# Altium schematic sheet cube.SchDoc
size A3
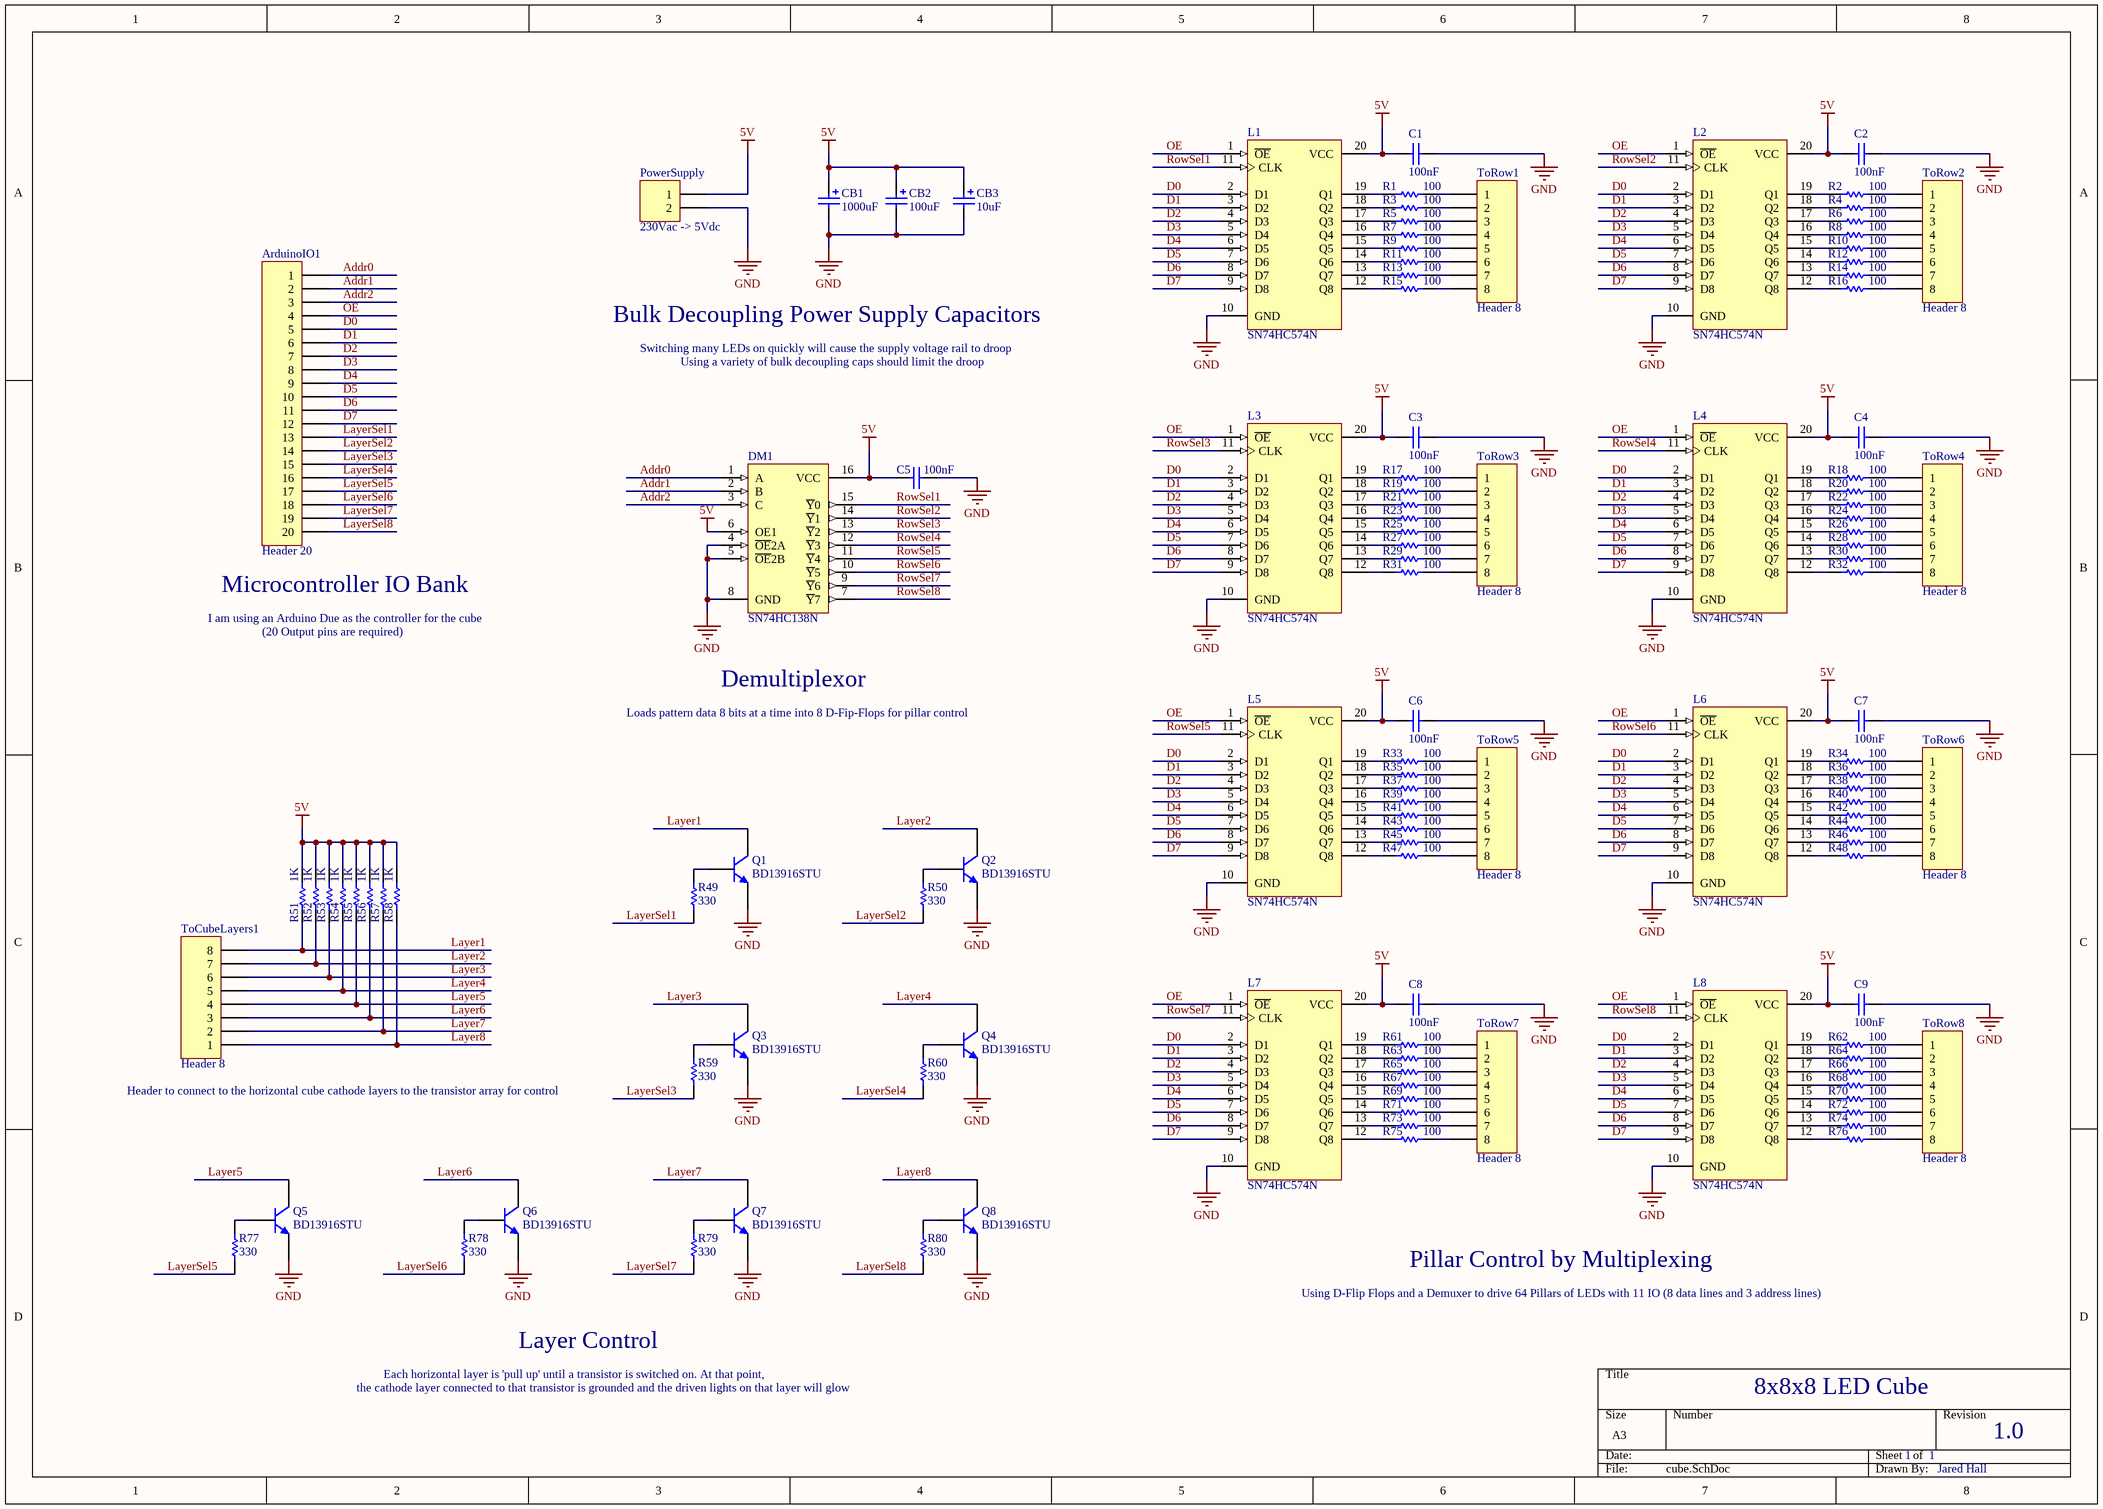
[diagram p0: cube.SchDoc]

## Parts
ArduinoIO1  Header 20  [HDR1X20]
C1  value 100nF  [RAD-0.3]  (hidden comment: Cap)
C2  value 100nF  [RAD-0.3]  (hidden comment: Cap)
C3  value 100nF  [RAD-0.3]  (hidden comment: Cap)
C4  value 100nF  [RAD-0.3]  (hidden comment: Cap)
C5  value 100nF  [RAD-0.3]  (hidden comment: Cap)
C6  value 100nF  [RAD-0.3]  (hidden comment: Cap)
C7  value 100nF  [RAD-0.3]  (hidden comment: Cap)
C8  value 100nF  [RAD-0.3]  (hidden comment: Cap)
C9  value 100nF  [RAD-0.3]  (hidden comment: Cap)
CB1  value 1000uF  [POLAR0.8]  (hidden comment: Cap Pol2)
CB2  value 100uF  [POLAR0.8]  (hidden comment: Cap Pol2)
CB3  value 10uF  [POLAR0.8]  (hidden comment: Cap Pol2)
DM1  SN74HC138N  [N016]
L1  SN74HC574N  [N020]
L2  SN74HC574N  [N020]
L3  SN74HC574N  [N020]
L4  SN74HC574N  [N020]
L5  SN74HC574N  [N020]
L6  SN74HC574N  [N020]
L7  SN74HC574N  [N020]
L8  SN74HC574N  [N020]
PowerSupply  230Vac -> 5Vdc  [HDR1X2]
Q1  BD13916STU  [TO-226-AA]
Q2  BD13916STU  [TO-226-AA]
Q3  BD13916STU  [TO-226-AA]
Q4  BD13916STU  [TO-226-AA]
Q5  BD13916STU  [TO-226-AA]
Q6  BD13916STU  [TO-226-AA]
Q7  BD13916STU  [TO-226-AA]
Q8  BD13916STU  [TO-226-AA]
R1  value 100  [AXIAL-0.3]  (hidden comment: Res1)
R2  value 100  [AXIAL-0.3]  (hidden comment: Res1)
R3  value 100  [AXIAL-0.3]  (hidden comment: Res1)
R4  value 100  [AXIAL-0.3]  (hidden comment: Res1)
R5  value 100  [AXIAL-0.3]  (hidden comment: Res1)
R6  value 100  [AXIAL-0.3]  (hidden comment: Res1)
R7  value 100  [AXIAL-0.3]  (hidden comment: Res1)
R8  value 100  [AXIAL-0.3]  (hidden comment: Res1)
R9  value 100  [AXIAL-0.3]  (hidden comment: Res1)
R10  value 100  [AXIAL-0.3]  (hidden comment: Res1)
R11  value 100  [AXIAL-0.3]  (hidden comment: Res1)
R12  value 100  [AXIAL-0.3]  (hidden comment: Res1)
R13  value 100  [AXIAL-0.3]  (hidden comment: Res1)
R14  value 100  [AXIAL-0.3]  (hidden comment: Res1)
R15  value 100  [AXIAL-0.3]  (hidden comment: Res1)
R16  value 100  [AXIAL-0.3]  (hidden comment: Res1)
R17  value 100  [AXIAL-0.3]  (hidden comment: Res1)
R18  value 100  [AXIAL-0.3]  (hidden comment: Res1)
R19  value 100  [AXIAL-0.3]  (hidden comment: Res1)
R20  value 100  [AXIAL-0.3]  (hidden comment: Res1)
R21  value 100  [AXIAL-0.3]  (hidden comment: Res1)
R22  value 100  [AXIAL-0.3]  (hidden comment: Res1)
R23  value 100  [AXIAL-0.3]  (hidden comment: Res1)
R24  value 100  [AXIAL-0.3]  (hidden comment: Res1)
R25  value 100  [AXIAL-0.3]  (hidden comment: Res1)
R26  value 100  [AXIAL-0.3]  (hidden comment: Res1)
R27  value 100  [AXIAL-0.3]  (hidden comment: Res1)
R28  value 100  [AXIAL-0.3]  (hidden comment: Res1)
R29  value 100  [AXIAL-0.3]  (hidden comment: Res1)
R30  value 100  [AXIAL-0.3]  (hidden comment: Res1)
R31  value 100  [AXIAL-0.3]  (hidden comment: Res1)
R32  value 100  [AXIAL-0.3]  (hidden comment: Res1)
R33  value 100  [AXIAL-0.3]  (hidden comment: Res1)
R34  value 100  [AXIAL-0.3]  (hidden comment: Res1)
R35  value 100  [AXIAL-0.3]  (hidden comment: Res1)
R36  value 100  [AXIAL-0.3]  (hidden comment: Res1)
R37  value 100  [AXIAL-0.3]  (hidden comment: Res1)
R38  value 100  [AXIAL-0.3]  (hidden comment: Res1)
R39  value 100  [AXIAL-0.3]  (hidden comment: Res1)
R40  value 100  [AXIAL-0.3]  (hidden comment: Res1)
R41  value 100  [AXIAL-0.3]  (hidden comment: Res1)
R42  value 100  [AXIAL-0.3]  (hidden comment: Res1)
R43  value 100  [AXIAL-0.3]  (hidden comment: Res1)
R44  value 100  [AXIAL-0.3]  (hidden comment: Res1)
R45  value 100  [AXIAL-0.3]  (hidden comment: Res1)
R46  value 100  [AXIAL-0.3]  (hidden comment: Res1)
R47  value 100  [AXIAL-0.3]  (hidden comment: Res1)
R48  value 100  [AXIAL-0.3]  (hidden comment: Res1)
R49  value 330  [AXIAL-0.3]  (hidden comment: Res1)
R50  value 330  [AXIAL-0.3]  (hidden comment: Res1)
R51  value 1K  [AXIAL-0.3]  (hidden comment: Res1)
R52  value 1K  [AXIAL-0.3]  (hidden comment: Res1)
R53  value 1K  [AXIAL-0.3]  (hidden comment: Res1)
R54  value 1K  [AXIAL-0.3]  (hidden comment: Res1)
R55  value 1K  [AXIAL-0.3]  (hidden comment: Res1)
R56  value 1K  [AXIAL-0.3]  (hidden comment: Res1)
R57  value 1K  [AXIAL-0.3]  (hidden comment: Res1)
R58  value 1K  [AXIAL-0.3]  (hidden comment: Res1)
R59  value 330  [AXIAL-0.3]  (hidden comment: Res1)
R60  value 330  [AXIAL-0.3]  (hidden comment: Res1)
R61  value 100  [AXIAL-0.3]  (hidden comment: Res1)
R62  value 100  [AXIAL-0.3]  (hidden comment: Res1)
R63  value 100  [AXIAL-0.3]  (hidden comment: Res1)
R64  value 100  [AXIAL-0.3]  (hidden comment: Res1)
R65  value 100  [AXIAL-0.3]  (hidden comment: Res1)
R66  value 100  [AXIAL-0.3]  (hidden comment: Res1)
R67  value 100  [AXIAL-0.3]  (hidden comment: Res1)
R68  value 100  [AXIAL-0.3]  (hidden comment: Res1)
R69  value 100  [AXIAL-0.3]  (hidden comment: Res1)
R70  value 100  [AXIAL-0.3]  (hidden comment: Res1)
R71  value 100  [AXIAL-0.3]  (hidden comment: Res1)
R72  value 100  [AXIAL-0.3]  (hidden comment: Res1)
R73  value 100  [AXIAL-0.3]  (hidden comment: Res1)
R74  value 100  [AXIAL-0.3]  (hidden comment: Res1)
R75  value 100  [AXIAL-0.3]  (hidden comment: Res1)
R76  value 100  [AXIAL-0.3]  (hidden comment: Res1)
R77  value 330  [AXIAL-0.3]  (hidden comment: Res1)
R78  value 330  [AXIAL-0.3]  (hidden comment: Res1)
R79  value 330  [AXIAL-0.3]  (hidden comment: Res1)
R80  value 330  [AXIAL-0.3]  (hidden comment: Res1)
ToCubeLayers1  Header 8  [HDR1X8]
ToRow1  Header 8  [HDR1X8]
ToRow2  Header 8  [HDR1X8]
ToRow3  Header 8  [HDR1X8]
ToRow4  Header 8  [HDR1X8]
ToRow5  Header 8  [HDR1X8]
ToRow6  Header 8  [HDR1X8]
ToRow7  Header 8  [HDR1X8]
ToRow8  Header 8  [HDR1X8]

## Nets
5V: C1.1 C2.1 C3.1 C4.1 C5.1 C6.1 C7.1 C8.1 C9.1 CB1.1 CB2.1 CB3.1 DM1.6(OE1) DM1.16(VCC) L1.20(VCC) L2.20(VCC) L3.20(VCC) L4.20(VCC) L5.20(VCC) L6.20(VCC) L7.20(VCC) L8.20(VCC) PowerSupply.1 R51.2 R52.2 R53.2 R54.2 R55.2 R56.2 R57.2 R58.2
GND: C1.2 C2.2 C3.2 C4.2 C5.2 C6.2 C7.2 C8.2 C9.2 CB1.2 CB2.2 CB3.2 DM1.4(~{OE}2A) DM1.5(~{OE}2B) DM1.8(GND) L1.10(GND) L2.10(GND) L3.10(GND) L4.10(GND) L5.10(GND) L6.10(GND) L7.10(GND) L8.10(GND) PowerSupply.2 Q1.3(E) Q2.3(E) Q3.3(E) Q4.3(E) Q5.3(E) Q6.3(E) Q7.3(E) Q8.3(E)
Addr0: ArduinoIO1.1 DM1.1(A)
Addr1: ArduinoIO1.2 DM1.2(B)
Addr2: ArduinoIO1.3 DM1.3(C)
D0: ArduinoIO1.5 L1.2(D1) L2.2(D1) L3.2(D1) L4.2(D1) L5.2(D1) L6.2(D1) L7.2(D1) L8.2(D1)
D1: ArduinoIO1.6 L1.3(D2) L2.3(D2) L3.3(D2) L4.3(D2) L5.3(D2) L6.3(D2) L7.3(D2) L8.3(D2)
D2: ArduinoIO1.7 L1.4(D3) L2.4(D3) L3.4(D3) L4.4(D3) L5.4(D3) L6.4(D3) L7.4(D3) L8.4(D3)
D3: ArduinoIO1.8 L1.5(D4) L2.5(D4) L3.5(D4) L4.5(D4) L5.5(D4) L6.5(D4) L7.5(D4) L8.5(D4)
D4: ArduinoIO1.9 L1.6(D5) L2.6(D5) L3.6(D5) L4.6(D5) L5.6(D5) L6.6(D5) L7.6(D5) L8.6(D5)
D5: ArduinoIO1.10 L1.7(D6) L2.7(D6) L3.7(D6) L4.7(D6) L5.7(D6) L6.7(D6) L7.7(D6) L8.7(D6)
D6: ArduinoIO1.11 L1.8(D7) L2.8(D7) L3.8(D7) L4.8(D7) L5.8(D7) L6.8(D7) L7.8(D7) L8.8(D7)
D7: ArduinoIO1.12 L1.9(D8) L2.9(D8) L3.9(D8) L4.9(D8) L5.9(D8) L6.9(D8) L7.9(D8) L8.9(D8)
Layer1: Q1.1(C) R51.1 ToCubeLayers1.8
Layer2: Q2.1(C) R52.1 ToCubeLayers1.7
Layer3: Q3.1(C) R53.1 ToCubeLayers1.6
Layer4: Q4.1(C) R54.1 ToCubeLayers1.5
Layer5: Q5.1(C) R55.1 ToCubeLayers1.4
Layer6: Q6.1(C) R56.1 ToCubeLayers1.3
Layer7: Q7.1(C) R57.1 ToCubeLayers1.2
Layer8: Q8.1(C) R58.1 ToCubeLayers1.1
LayerSel1: ArduinoIO1.13 R49.1
LayerSel2: ArduinoIO1.14 R50.1
LayerSel3: ArduinoIO1.15 R59.1
LayerSel4: ArduinoIO1.16 R60.1
LayerSel5: ArduinoIO1.17 R77.1
LayerSel6: ArduinoIO1.18 R78.1
LayerSel7: ArduinoIO1.19 R79.1
LayerSel8: ArduinoIO1.20 R80.1
OE: ArduinoIO1.4 L1.1(~{OE}) L2.1(~{OE}) L3.1(~{OE}) L4.1(~{OE}) L5.1(~{OE}) L6.1(~{OE}) L7.1(~{OE}) L8.1(~{OE})
RowSel1: DM1.15(~{Y}0) L1.11(CLK)
RowSel2: DM1.14(~{Y}1) L2.11(CLK)
RowSel3: DM1.13(~{Y}2) L3.11(CLK)
RowSel4: DM1.12(~{Y}3) L4.11(CLK)
RowSel5: DM1.11(~{Y}4) L5.11(CLK)
RowSel6: DM1.10(~{Y}5) L6.11(CLK)
RowSel7: DM1.9(~{Y}6) L7.11(CLK)
RowSel8: DM1.7(~{Y}7) L8.11(CLK)
NetL1_12: L1.12(Q8) R15.1
NetL1_13: L1.13(Q7) R13.1
NetL1_14: L1.14(Q6) R11.1
NetL1_15: L1.15(Q5) R9.1
NetL1_16: L1.16(Q4) R7.1
NetL1_17: L1.17(Q3) R5.1
NetL1_18: L1.18(Q2) R3.1
NetL1_19: L1.19(Q1) R1.1
NetL2_12: L2.12(Q8) R16.1
NetL2_13: L2.13(Q7) R14.1
NetL2_14: L2.14(Q6) R12.1
NetL2_15: L2.15(Q5) R10.1
NetL2_16: L2.16(Q4) R8.1
NetL2_17: L2.17(Q3) R6.1
NetL2_18: L2.18(Q2) R4.1
NetL2_19: L2.19(Q1) R2.1
NetL3_12: L3.12(Q8) R31.1
NetL3_13: L3.13(Q7) R29.1
NetL3_14: L3.14(Q6) R27.1
NetL3_15: L3.15(Q5) R25.1
NetL3_16: L3.16(Q4) R23.1
NetL3_17: L3.17(Q3) R21.1
NetL3_18: L3.18(Q2) R19.1
NetL3_19: L3.19(Q1) R17.1
NetL4_12: L4.12(Q8) R32.1
NetL4_13: L4.13(Q7) R30.1
NetL4_14: L4.14(Q6) R28.1
NetL4_15: L4.15(Q5) R26.1
NetL4_16: L4.16(Q4) R24.1
NetL4_17: L4.17(Q3) R22.1
NetL4_18: L4.18(Q2) R20.1
NetL4_19: L4.19(Q1) R18.1
NetL5_12: L5.12(Q8) R47.1
NetL5_13: L5.13(Q7) R45.1
NetL5_14: L5.14(Q6) R43.1
NetL5_15: L5.15(Q5) R41.1
NetL5_16: L5.16(Q4) R39.1
NetL5_17: L5.17(Q3) R37.1
NetL5_18: L5.18(Q2) R35.1
NetL5_19: L5.19(Q1) R33.1
NetL6_12: L6.12(Q8) R48.1
NetL6_13: L6.13(Q7) R46.1
NetL6_14: L6.14(Q6) R44.1
NetL6_15: L6.15(Q5) R42.1
NetL6_16: L6.16(Q4) R40.1
NetL6_17: L6.17(Q3) R38.1
NetL6_18: L6.18(Q2) R36.1
NetL6_19: L6.19(Q1) R34.1
NetL7_12: L7.12(Q8) R75.1
NetL7_13: L7.13(Q7) R73.1
NetL7_14: L7.14(Q6) R71.1
NetL7_15: L7.15(Q5) R69.1
NetL7_16: L7.16(Q4) R67.1
NetL7_17: L7.17(Q3) R65.1
NetL7_18: L7.18(Q2) R63.1
NetL7_19: L7.19(Q1) R61.1
NetL8_12: L8.12(Q8) R76.1
NetL8_13: L8.13(Q7) R74.1
NetL8_14: L8.14(Q6) R72.1
NetL8_15: L8.15(Q5) R70.1
NetL8_16: L8.16(Q4) R68.1
NetL8_17: L8.17(Q3) R66.1
NetL8_18: L8.18(Q2) R64.1
NetL8_19: L8.19(Q1) R62.1
NetQ1_2: Q1.2(B) R49.2
NetQ2_2: Q2.2(B) R50.2
NetQ3_2: Q3.2(B) R59.2
NetQ4_2: Q4.2(B) R60.2
NetQ5_2: Q5.2(B) R77.2
NetQ6_2: Q6.2(B) R78.2
NetQ7_2: Q7.2(B) R79.2
NetQ8_2: Q8.2(B) R80.2
NetR1_2: R1.2 ToRow1.1
NetR2_2: R2.2 ToRow2.1
NetR3_2: R3.2 ToRow1.2
NetR4_2: R4.2 ToRow2.2
NetR5_2: R5.2 ToRow1.3
NetR6_2: R6.2 ToRow2.3
NetR7_2: R7.2 ToRow1.4
NetR8_2: R8.2 ToRow2.4
NetR9_2: R9.2 ToRow1.5
NetR10_2: R10.2 ToRow2.5
NetR11_2: R11.2 ToRow1.6
NetR12_2: R12.2 ToRow2.6
NetR13_2: R13.2 ToRow1.7
NetR14_2: R14.2 ToRow2.7
NetR15_2: R15.2 ToRow1.8
NetR16_2: R16.2 ToRow2.8
NetR17_2: R17.2 ToRow3.1
NetR18_2: R18.2 ToRow4.1
NetR19_2: R19.2 ToRow3.2
NetR20_2: R20.2 ToRow4.2
NetR21_2: R21.2 ToRow3.3
NetR22_2: R22.2 ToRow4.3
NetR23_2: R23.2 ToRow3.4
NetR24_2: R24.2 ToRow4.4
NetR25_2: R25.2 ToRow3.5
NetR26_2: R26.2 ToRow4.5
NetR27_2: R27.2 ToRow3.6
NetR28_2: R28.2 ToRow4.6
NetR29_2: R29.2 ToRow3.7
NetR30_2: R30.2 ToRow4.7
NetR31_2: R31.2 ToRow3.8
NetR32_2: R32.2 ToRow4.8
NetR33_2: R33.2 ToRow5.1
NetR34_2: R34.2 ToRow6.1
NetR35_2: R35.2 ToRow5.2
NetR36_2: R36.2 ToRow6.2
NetR37_2: R37.2 ToRow5.3
NetR38_2: R38.2 ToRow6.3
NetR39_2: R39.2 ToRow5.4
NetR40_2: R40.2 ToRow6.4
NetR41_2: R41.2 ToRow5.5
NetR42_2: R42.2 ToRow6.5
NetR43_2: R43.2 ToRow5.6
NetR44_2: R44.2 ToRow6.6
NetR45_2: R45.2 ToRow5.7
NetR46_2: R46.2 ToRow6.7
NetR47_2: R47.2 ToRow5.8
NetR48_2: R48.2 ToRow6.8
NetR61_2: R61.2 ToRow7.1
NetR62_2: R62.2 ToRow8.1
NetR63_2: R63.2 ToRow7.2
NetR64_2: R64.2 ToRow8.2
NetR65_2: R65.2 ToRow7.3
NetR66_2: R66.2 ToRow8.3
NetR67_2: R67.2 ToRow7.4
NetR68_2: R68.2 ToRow8.4
NetR69_2: R69.2 ToRow7.5
NetR70_2: R70.2 ToRow8.5
NetR71_2: R71.2 ToRow7.6
NetR72_2: R72.2 ToRow8.6
NetR73_2: R73.2 ToRow7.7
NetR74_2: R74.2 ToRow8.7
NetR75_2: R75.2 ToRow7.8
NetR76_2: R76.2 ToRow8.8

## Notes on the sheet
- Bulk Decoupling Power Supply Capacitors
- Switching many LEDs on quickly will cause the supply voltage rail to droop
- Using a variety of bulk decoupling caps should limit the droop
- I am using an Arduino Due as the controller for the cube
- (near ArduinoIO1) Microcontroller IO Bank
- (20 Output pins are required)
- Loads pattern data 8 bits at a time into 8 D-Fip-Flops for pillar control
- Demultiplexor
- (near R59) Header to connect to the horizontal cube cathode layers to the transistor array for control
- Using D-Flip Flops and a Demuxer to drive 64 Pillars of LEDs with 11 IO (8 data lines and 3 address lines)
- Pillar Control by Multiplexing
- the cathode layer connected to that transistor is grounded and the driven lights on that layer will glow
- Each horizontal layer is 'pull up' until a transistor is switched on. At that point,
- Layer Control
- 8x8x8 LED Cube
- 1      1
- 1.0
- Jared Hall

## Library data of the parts
ArduinoIO1 = Header 20: Header, 20-Pin; LatestRevisionDate: 17-Jul-2002; LatestRevisionNote: Re-released for DXP Platform.; Publisher: Altium Limited
C1-C9 = Cap: Capacitor; Published: 8-Jun-2000; LatestRevisionDate: 17-Jul-2002; LatestRevisionNote: Re-released for DXP Platform.; PackageReference: RAD-0.3; Publisher: Altium Limited; PackageDescription: Radial Cap, Thru-Hole; 2 Leads; 0.3 in Pin Spacing
CB1-CB3 = Cap Pol2: Polarized Capacitor (Axial); Published: 8-Jun-2000; LatestRevisionDate: 17-Jul-2002; LatestRevisionNote: Re-released for DXP Platform.; PackageReference: POLAR0.8; Publisher: Altium Limited; PackageDescription: Polarized Capacitor; 2 Leads
DM1 = SN74HC138N: 3-Line to 8-Line Decoder / Demultiplexer; Published: 8-Jun-2000; LatestRevisionDate: 04-Mar-2005; LatestRevisionNote: Stylized 3D Model Added.; DatasheetVersion: May-1997; PackageVersion: Oct-1995; PackageReference: N016; Publisher: Altium Limited; PackageDescription: DIP; 16 Leads; Row Spacing 7.62 mm; Pitch 2.54 mm; Code_JEDEC: MS-001-BB; ComponentLink1Description: Manufacturer Link; ComponentLink1URL: http://www.ti.com/; ComponentLink2Description: Datasheet; ComponentLink2URL: http://www-s.ti.com/sc/ds/sn74hc138.pdf
L1-L8 = SN74HC574N: Octal Edge-Triggered D-Type Flip-Flop with 3-State Outputs; Published: 8-Jun-2000; LatestRevisionDate: 04-Mar-2005; LatestRevisionNote: Stylized 3D Model Added.; DatasheetVersion: Jan-1998; PackageVersion: Oct-1995; PackageReference: N020; Publisher: Altium Limited; PackageDescription: DIP; 20 Leads; Row Spacing 7.62 mm; Pitch 2.54 mm; ComponentLink1Description: Manufacturer Link; ComponentLink1URL: http://www.ti.com/; ComponentLink2Description: Datasheet; ComponentLink2URL: http://www-s.ti.com/sc/ds/sn74hc574.pdf
PowerSupply = Header 2: Header, 2-Pin; LatestRevisionDate: 17-Jul-2002; LatestRevisionNote: Re-released for DXP Platform.; Publisher: Altium Limited
Q1-Q8 = NPN: NPN Bipolar Transistor; Published: 8-Jun-2000; LatestRevisionDate: 17-Jul-2002; LatestRevisionNote: Re-released for DXP Platform.; PackageReference: TO-226-AA; Publisher: Altium Limited; PackageDescription: TO, Flat Index; 3 In-Line, Axial Leads; Body Dia. 4.8mm; Leads 0.55 x 0.51 mm (max); Code_JEDEC: TO-226-AA
R1-R80 = Res1: Resistor; Published: 8-Jun-2000; LatestRevisionDate: 17-Jul-2002; LatestRevisionNote: Re-released for DXP Platform.; PackageReference: AXIAL-0.3; Publisher: Altium Limited; PackageDescription: Axial Device, Thru-Hole; 2 Leads; 0.3 in Pin Spacing
ToCubeLayers1 ToRow1-ToRow8 = Header 8: Header, 8-Pin; LatestRevisionDate: 17-Jul-2002; LatestRevisionNote: Re-released for DXP Platform.; Publisher: Altium Limited